# EAGLE design MEMS-preamp_v03 (EAGLE 8.0.1)
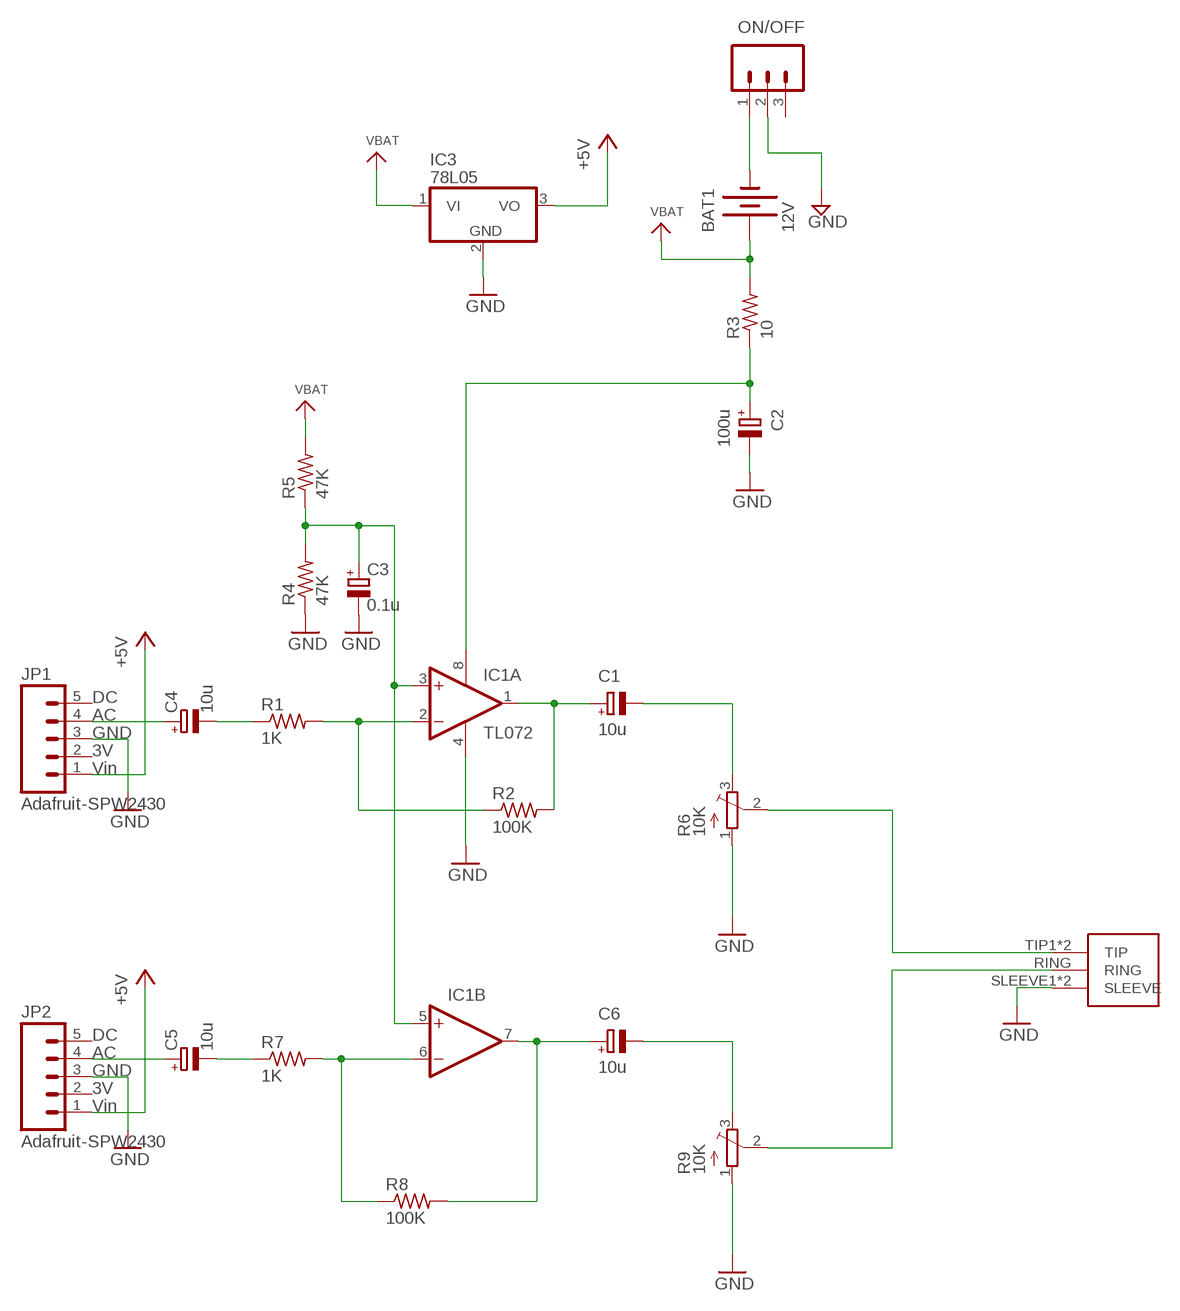
[diagram p0: schematic, sheet 1]

## Parts
BAT1  12V  BATTERYA23  [BATTERY-A23]
C1  10u  CPOL-EUE2.5-5  [E2,5-5]
C2  100u  CPOL-EUE2.5-5  [E2,5-5]
C3  0.1u  CPOL-EUE2.5-5  [E2,5-5]
C4  10u  CPOL-EUE2.5-5  [E2,5-5]
C5  10u  CPOL-EUE2.5-5  [E2,5-5]
C6  10u  CPOL-EUE2.5-5  [E2,5-5]
IC1  OPA2134PA  [DIL08]
IC3  78L05  78  [TO92-]
JP1  Adafruit-SPW2430  M05LOCK  [1X05_LOCK]
JP2  Adafruit-SPW2430  M05LOCK  [1X05_LOCK]
ON/OFF  labl  M03SINGLE-POLE-DOUBLE-THROW  [SPDT-SWITCH]
R1  1K  R-US_0204/2V  [0204V]
R2  100K  R-US_0204/2V  [0204V]
R3  10  R-US_0204/2V  [0204V]
R4  47K  R-US_0204/2V  [0204V]
R5  47K  R-US_0204/2V  [0204V]
R6  10K  TRIMPOT3386  [TRIM-3386]
R7  1K  R-US_0204/2V  [0204V]
R8  100K  R-US_0204/2V  [0204V]
R9  10K  TRIMPOT3386  [TRIM-3386]
U$1  1/8"-F-STEREO-PCB  [1/8"-F-STEREO-PCB]

## Nets
+5V: IC3.3(VO) JP1.1 JP2.1
GND: C2.- C3.- IC1.4(A:V-) IC3.2(GND) JP1.3 JP2.3 ON/OFF.2 R4.1 R6.1(A) R9.1(A) U$1.SLEEVE1(SLEEVE) U$1.SLEEVE2(SLEEVE)
N$1: C2.+ IC1.8(A:V+) R3.1
N$2: BAT1.GND@1(-) ON/OFF.1
N$3: C4.+ JP1.4
N$4: C4.- R1.1
N$5: IC1.2(A:-IN) R1.2 R2.1
N$6: C1.- R6.3(E)
N$7: R6.2(S) U$1.TIP1(TIP) U$1.TIP2(TIP)
N$8: C3.+ IC1.3(A:+IN) IC1.5(B:+IN) R4.2 R5.1
N$9: C1.+ IC1.1(A:OUT) R2.2
N$10: C5.+ JP2.4
N$11: C5.- R7.1
N$12: IC1.6(B:-IN) R7.2 R8.1
N$13: C6.+ IC1.7(B:OUT) R8.2
N$14: C6.- R9.3(E)
N$15: R9.2(S) U$1.RING
VBAT: BAT1.PWR@1(+) IC3.1(VI) R3.2 R5.2
Unconnected: JP1.2 JP1.5 JP2.2 JP2.5 ON/OFF.3

## Library data of the parts
BAT1 = Daniel:BATTERY: Battery Holders Various common sizes : AA, AAA, 18650 (PRT-12895), 20mm coin cell and 12mm coin cell. 20MM_4LEGS, BATT-10373
C1-C6 = rcl:CPOL-EU: POLARIZED CAPACITOR, European symbol
IC1 = linear:OPA2*: Dual Operational Amplifier Low Power, Single-Supply, Rail-To-Rail Operational Amplifier Source: http://focus.ti.com/lit/ds/symlink/opa2345.pdf http://focus.ti.com .. opa241.pdf http://focus.ti.com/lit/ds/symlink/opa2134.pdf; IC_NAME: TL072
IC3 = CMU-ArtFab:78*: Positive VOLTAGE REGULATOR Added bigger pads to the TO-92 package
JP1 JP2 = SparkFun-Connectors:M05: Header 5 Standard 5-pin 0.1" header. Use with straight break away headers (SKU : PRT-00116), right angle break away headers (PRT-00553), swiss pins (PRT-00743), machine pins (PRT-00117), and female headers (PRT-00115). Molex polarized connector foot print use with SKU : PRT-08230 with associated crimp pins and housings.; CON1: Vin; CON2: 3V; CON3: GND; CON4: AC; CON5: DC
ON/OFF = Daniel:M03: Single Pole Double Throw Switch 2.0mm pitch 3-pin header for switch.
R1-R5 R7 R8 = CMU-ArtFab:R-US_: RESISTOR, American symbol
R6 R9 = adafruit:TRIMPOT: SMT trimmer potentiometer part number TC33X http://www.ladyada.net/library/eagle
U$1 = CMU-ArtFab:1/8"-F-STEREO-PCB

## Board
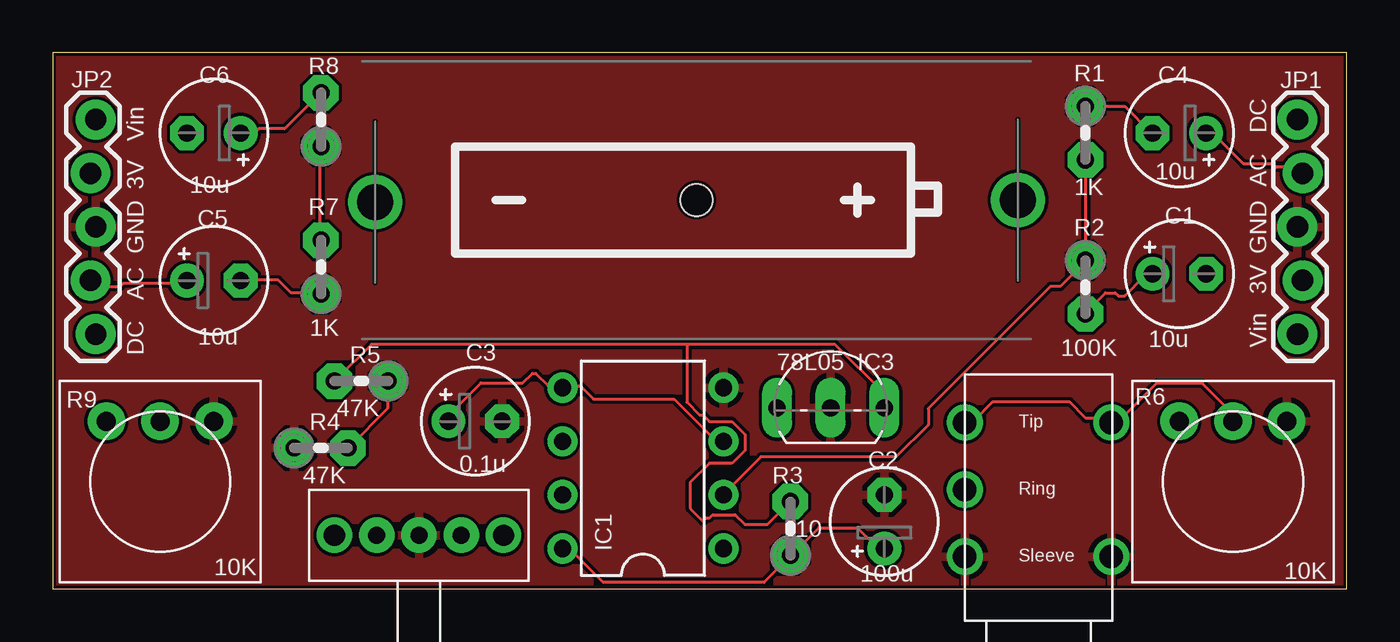
[diagram p1: board, top side]
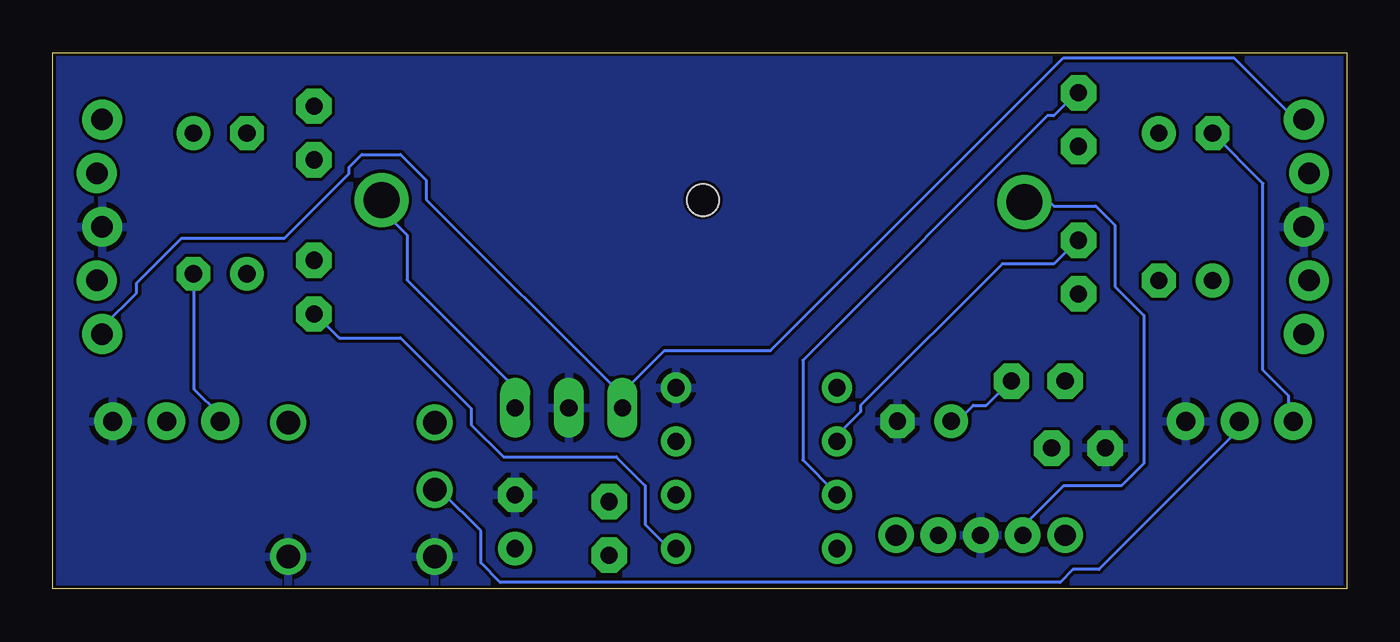
[diagram p2: board, bottom side, seen from below]

Size 61.27 x 25.39 mm. Coordinates in mm from the lower left corner, seen from the top.
Outline: 0,0 61.27,0 61.27,25.39 0,25.39 0,0
Copper layers (1*16): Top 0.035mm / dielectric 1.5mm / Bottom 0.035mm
Design rules "default *": minimum track width 6mil, minimum drill 6mil, track to track 6mil, track to pad 6mil, pad to pad 6mil, via to via 6mil, smd to smd 6mil, copper to edge 6mil, drill to drill 6mil, minimum pad ring 12mil, minimum via ring 12mil, stop-mask expansion 4mil, vias tented up to drill 0mil, thermal gap 10mil

### Footprints (pad centres in the part's own frame; a part is rotated, then mirrored left to right if it is on the bottom)
BATTERY-A23 = drill 1.702: GND@1 15.22,0.1; PWR@1 -15.22,0 | hole 1.524: 0,0
E2,5-5 = drill 0.813 pad 1.6: + -1.27,0 | drill 0.813 pad 1.6 octagon: - 1.27,0
DIL08 = drill 0.813 pad 1.27: 1 -3.81,-3.81; 2 -1.27,-3.81; 3 1.27,-3.81; 4 3.81,-3.81; 5 3.81,3.81; 6 1.27,3.81; 7 -1.27,3.81; 8 -3.81,3.81
TO92- = drill 0.813 long: 1 2.54,0; 2 0,0; 3 -2.54,0
1X05_LOCK = drill 1.016 pad 1.88: 1 0,0.127; 2 2.54,-0.127; 3 5.08,0.127; 4 7.62,-0.127; 5 10.16,0.127
SPDT-SWITCH = drill 0.8 pad 1.676: 1 2,0; 2 4,0; 3 6,0 | drill 1 pad 1.676: P$1 0,0; P$2 8,0
0204V = drill 0.813 pad 1.676 octagon: 1 -1.27,0; 2 1.27,0
TRIM-3386 = drill 0.9 pad 1.778: 1 -2.54,-2.857; 2 0,-2.857; 3 2.54,-2.857
1/8"-F-STEREO-PCB = drill 1.1: RING 5.461,0; SLEEVE1 8.636,6.934; SLEEVE2 8.636,0; TIP1 2.286,6.934; TIP2 2.286,0

### Placement (x,y rotation side)
BAT1  30.48,18.41 180 top
C1  53.34,14.92 0 top
C2  39.37,3.17 90 top
C3  20,7.94 0 top
C4  53.34,21.59 180 top
C5  7.62,14.61 0 top
C6  7.62,21.59 180 top
IC1  27.94,5.71 90 top
IC3  36.83,8.57 0 top
JP1  59.05,12.06 90 top
JP2  1.91,22.23 270 top
ON/OFF  13.34,2.54 0 top
R1  48.9,21.59 270 top
R2  48.9,14.29 270 top
R3  34.92,2.86 90 top
R4  12.7,6.67 0 top
R5  14.61,9.84 180 top
R6  55.88,5.08 180 top
R7  12.7,15.24 90 top
R8  12.7,22.23 90 top
R9  5.08,5.08 180 top
U$1  43.18,10.16 270 top

### Tracks (layer width: path | path; a pad name or v marks a point on that pad's centre or on a via)
+5V
  Bottom 0.152: 34.44,9.3 43.59,18.44 43.59,19.36 44.81,20.57 46.63,20.57 47.24,19.96 47.24,19.66 50.29,16.61 55.17,16.61 57.3,14.48 57.3,14.02 58.83,12.5 58.83,12.19 JP1.1 | 34.44,9.3 34.29,9.14 IC3.3 34.44,9.3 | 34.44,9.3 34.29,9.3 32.31,11.28 27.28,11.28 13.41,25.15 5.33,25.15 2.44,22.25 2.13,22.25 JP2.1
GND
  pour Bottom: -1.27,-1.27 62.23,-1.27 62.23,26.67 -1.27,26.67
  pour Top: -1.27,26.67 62.23,26.67 62.23,-1.27 -1.27,-1.27
N$1
  Top 0.152: IC1.8 24.23,1.83 24.54,1.83 26.06,0.3 33.68,0.3 34.9,1.52 R3.1 35.05,1.68 36.27,2.9 38.1,2.9 39.01,1.98 39.32,1.98 C2.+
N$2
  Bottom 0.152: ON/OFF.1 15.24,2.59 15.24,3.05 13.41,4.88 10.67,4.88 9.6,5.94 9.6,12.95 10.97,14.33 10.97,17.22 11.89,18.14 13.87,18.14 14.02,18.29 15.24,18.29 BAT1.GND@1
N$3
  Top 0.152: C4.+ 54.71,21.49 55.02,21.49 56.39,20.12 57.76,20.12 57.91,19.96 58.98,19.96 59.13,19.81 JP1.4
N$4
  Top 0.152: R1.1 50.75,22.86 51.97,21.64 C4.-
N$5
  Top 0.152: IC1.2 31.85,4.57 33.53,6.25 39.93,6.25 41.45,7.77 41.45,8.53 47.24,14.33 47.7,14.33 48.92,15.54 R2.1 48.92,15.7 48.92,20.27 R1.2
N$6
  Bottom 0.152: R6.3 53.34,8.23 54.56,9.45 54.56,14.78 C1.-
N$7
  Top 0.152: U$1.TIP2 43.28,7.92 43.59,7.92 44.5,8.84 48.16,8.84 48.92,8.08 49.84,8.08 49.99,7.92 U$1.TIP1 50.14,7.92 50.44,7.92 52.27,9.75 54.41,9.75 55.78,8.38 55.78,8.08 R6.2
N$8
  Top 0.152: R4.2 14.02,6.71 15.85,8.53 15.85,9.75 R5.1 | C3.+ 18.59,8.08 20.27,9.75 22.25,9.75 22.71,10.21 22.86,10.21 23.47,9.6 24.08,9.6 IC1.5 24.23,9.6 24.99,9.6 25.6,8.99 29.41,8.99 31.39,7.01 31.7,7.01 IC1.3
  Bottom 0.152: R5.1 16,9.75 17.07,8.69 17.68,8.69 18.29,8.08 18.59,8.08 C3.+
N$9
  Top 0.152: C1.+ 51.97,14.78 51.66,14.78 50.75,13.87 50.44,13.87 50.29,14.02 49.84,14.02 48.92,13.11 R2.2
  Bottom 0.152: IC1.1 31.85,1.98 32.16,1.98 33.22,3.05 33.22,4.88 34.59,6.25 39.93,6.25 41.45,7.77 41.45,8.53 44.81,11.89 47.7,11.89 48.77,12.95 R2.2
N$10
  Top 0.152: C5.+ 6.25,14.48 3.35,14.48 3.2,14.33 1.98,14.33 1.83,14.48 JP2.4
N$11
  Top 0.152: C5.- 8.99,14.63 10.67,14.63 11.28,14.02 12.65,14.02 R7.1
N$12
  Top 0.152: R8.1 12.65,20.88 12.65,16.61 R7.2
  Bottom 0.152: IC1.6 24.08,7.01 24.08,7.32 23.01,8.38 23.01,8.69 16.31,15.39 13.87,15.39 12.8,16.46 R7.2
N$13
  Top 0.152: C6.+ 8.99,21.64 9.6,21.64 9.75,21.79 10.97,21.79 12.65,23.47 R8.2
  Bottom 0.152: IC1.7 24.23,4.57 25.76,6.1 25.76,10.82 14.17,22.4 13.87,22.4 12.8,23.47 R8.2
N$14
  Bottom 0.152: C6.- 3.96,19.2 3.96,10.36 2.74,9.14 2.74,8.23 2.59,8.08 R9.3
N$15
  Bottom 0.152: U$1.RING 43.13,4.57 42.82,4.57 41,2.74 41,1.22 40.08,0.3 13.56,0.3 12.95,0.91 11.73,0.91 5.18,7.47 5.18,7.92 R9.2
VBAT
  Top 0.152: 30.02,11.58 37.03,11.58 39.32,9.3 39.32,8.69 IC3.1 | 30.02,11.58 15.09,11.58 13.41,9.91 R5.2 | 30.02,11.58 30.02,8.84 30.63,8.23 30.79,8.23 31.09,7.92 32.16,7.92 32.77,7.32 32.77,6.55 32.16,5.94 31.09,5.94 30.18,5.03 30.18,3.81 30.79,3.2 30.94,3.35 31.09,3.35 31.24,3.5 32.31,3.5 32.77,3.05 33.83,3.05 34.9,4.12 R3.2
  Bottom 0.152: IC3.1 39.47,8.69 39.47,9.6 44.5,14.63 44.5,16.76 45.57,17.83 45.57,18.29 BAT1.PWR@1